# EAGLE design tea_breakout (EAGLE 6.4)
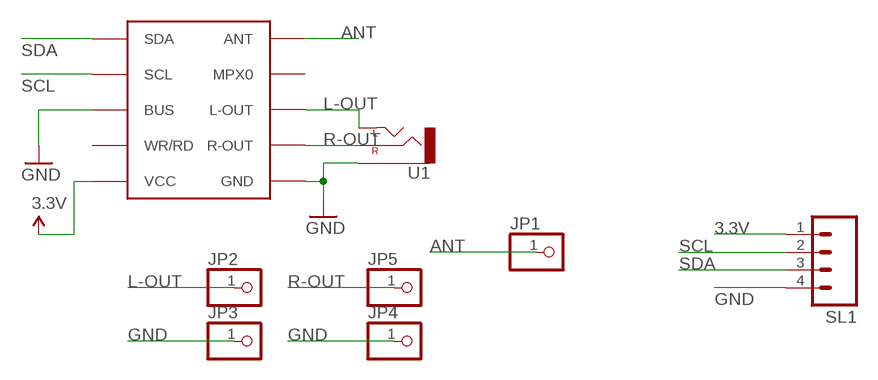
[diagram p0: schematic, sheet 1]

## Parts
JP1  PINHD-1X1  [1X01]
JP2  PINHD-1X1  [1X01]
JP3  PINHD-1X1  [1X01]
JP4  PINHD-1X1  [1X01]
JP5  PINHD-1X1  [1X01]
SL1  M041X04_NO_SILK  [1X04_NO_SILK]
U1  AUDIO-JACKPTH  [AUDIO-JACK]
U$1  PL102BC-N  [PL102BC-N]

## Nets
3.3V: SL1.1 U$1.PAD5(VCC)
ANT: JP1.1 U$1.PAD11(ANT)
GND: JP3.1 JP4.1 SL1.4 U1.SLEEVE U$1.PAD3(BUS) U$1.PAD6(GND)
L-OUT: JP2.1 U1.TIP(LEFT) U$1.PAD9(L-OUT)
R-OUT: JP5.1 U1.RING(RIGHT) U$1.PAD7(R-OUT)
SCL: SL1.2 U$1.PAD2(SCL)
SDA: SL1.3 U$1.PAD1(SDA)
Unconnected: U$1.PAD4(WR/RD) U$1.PAD10(MPX0)

## Library data of the parts
JP1-JP5 = adafruit:PINHD-1X1: Pin header 1x1 for 0.1" spacing With round pins
SL1 = SparkFun-Connectors:M04: Header 4 Standard 4-pin 0.1" header. Use with straight break away headers (SKU : PRT-00116), right angle break away headers (PRT-00553), swiss pins (PRT-00743), machine pins (PRT-00117), and female headers (PRT-00115). Molex polarized connector foot print use with SKU : PRT-08231 with associated crimp pins and housings. 1MM SMD Version SKU: PRT-10208
U1 = SparkFun-Connectors:AUDIO-JACK: 3.5mm Audio Jack Simple 3.5mm common PCB mount audio jack. SKU: PRT-08032
U$1 = PialEagle:PL102BC-N: PL102BC-N FM receiver module based on TEA5767 chip

## Net classes
1 Ground: width 0.1 mm, drill 0.2 mm

## Board
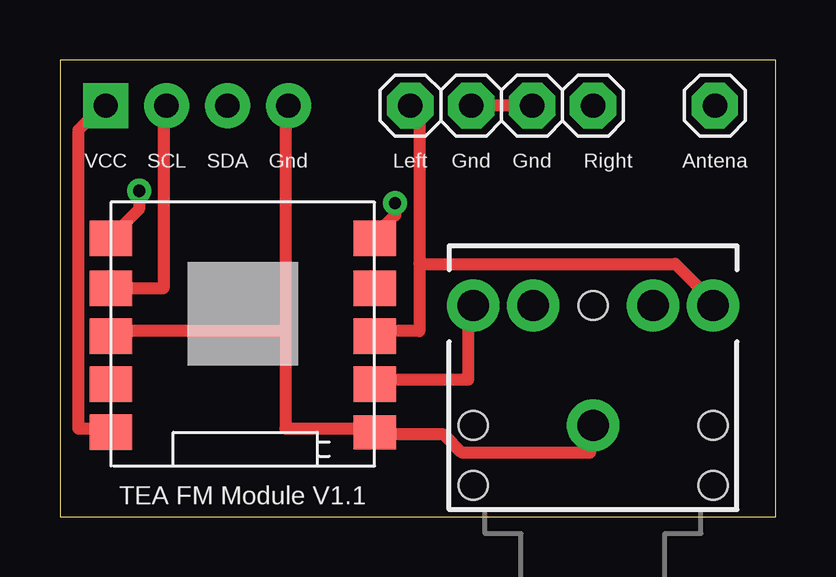
[diagram p1: board, top side]
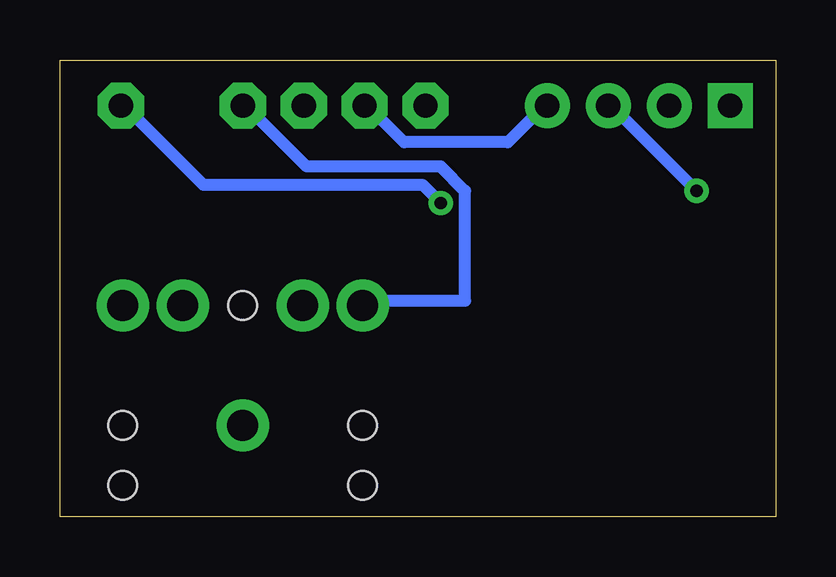
[diagram p2: board, bottom side, seen from below]

Size 29.84 x 19.05 mm. Coordinates in mm from the lower left corner, seen from the top.
Outline: 0,0 18.41,0 19.05,0 28.57,0 29.84,0 29.84,19.05 0,19.05 0,0
Copper layers (1*16): Top 0.035mm / dielectric 1.5mm / Bottom 0.035mm
Design rules "SparkFun *": minimum track width 20mil, minimum drill 20mil, track to track 8mil, track to pad 8mil, pad to pad 8mil, via to via 8mil, smd to smd 8mil, copper to edge 10mil, drill to drill 8mil, minimum pad ring 12mil, minimum via ring 10mil, stop-mask expansion 4mil, vias tented up to drill 25mil, thermal gap 10mil

### Footprints (pad centres in the part's own frame; a part is rotated, then mirrored left to right if it is on the bottom)
1X01 = drill 1.016 pad 1.93 octagon: 1 0,0
1X04_NO_SILK = drill 1.016 pad 1.88 square: 1 0,0 | drill 1.016 pad 1.88: 2 2.54,0; 3 5.08,0; 4 7.62,0
AUDIO-JACK = drill 1.3 pad 2.184: RING 5,5; RSH 5,2.5; SLEEVE 0,0; TIP 5,-5; TSH 5,-2.5 | hole 1.2: 0,5; -2.5,5; -2.5,-5; 0,-5; 5,0
PL102BC-N = smd 1.778 x 1.48: PAD1 -5.5,4; PAD2 -5.5,1.9; PAD3 -5.5,-0.1; PAD4 -5.5,-2.1; PAD5 -5.5,-4.1; PAD7 5.5,-2.1; PAD9 5.5,-0.1; PAD10 5.5,1.9; PAD11 5.5,4 | smd 1.778 x 1.4: PAD6 5.5,-4.1

### Placement (x,y rotation side)
JP1  27.3,17.15 0 top
JP2  14.6,17.15 0 top
JP3  17.15,17.15 0 top
JP4  19.69,17.15 0 top
JP5  22.23,17.15 0 top
SL1  1.91,17.15 0 top
U1  22.23,3.81 90 top
U$1  7.62,7.62 0 top

### Tracks (layer width: path | path; a pad name or v marks a point on that pad's centre or on a via)
3.3V
  Top 0.508: U$1.PAD5 2.03,3.68 0.76,3.68 0.76,16.13 1.78,17.15 SL1.1
ANT  (via drill 0.51)
  Top 0.508: v13.97,13.08 13.97,12.57 13.21,11.81 U$1.PAD11
  Bottom 0.508: v13.97,13.08 14.73,13.84 23.88,13.84 27.18,17.15 JP1.1
GND
  Top 0.508: U1.SLEEVE 22.1,3.68 22.1,2.67 16.76,2.67 16,3.43 13.21,3.43 U$1.PAD6 12.95,3.68 9.4,3.68 9.4,7.75 | JP3.1 17.27,17.15 19.56,17.15 JP4.1 | 9.4,7.75 2.29,7.75 U$1.PAD3 | 9.4,7.75 9.4,17.15 SL1.4
  Bottom 0.508: JP3.1 17.02,17.15 15.49,15.62 11.18,15.62 9.65,17.15 SL1.4
L-OUT
  Top 0.508: 14.99,10.54 14.99,16.89 14.73,17.15 JP2.1 | 14.99,10.54 14.99,7.75 13.21,7.75 U$1.PAD9 | 14.99,10.54 25.65,10.54 27.18,9.02 U1.TIP
R-OUT
  Top 0.508: U$1.PAD7 13.21,5.71 17.02,5.71 17.02,8.76 U1.RING
  Bottom 0.508: JP5.1 22.1,17.15 19.56,14.61 13.97,14.61 12.95,13.59 12.95,9.02 17.02,9.02 U1.RING
SCL
  Top 0.508: U$1.PAD2 2.29,9.52 4.32,9.52 4.32,17.15 SL1.2
SDA  (via drill 0.51)
  Top 0.508: v3.3,13.59 3.3,12.83 2.29,11.81 U$1.PAD1
  Bottom 0.508: v3.3,13.59 6.86,17.15 SL1.3

### Text on the board
tNames: VCC | SCL | SDA | Gnd | Left | Gnd | Gnd | Right | Antena | TEA FM Module V1.1